# EAGLE design sensor 8 (EAGLE 5.06)
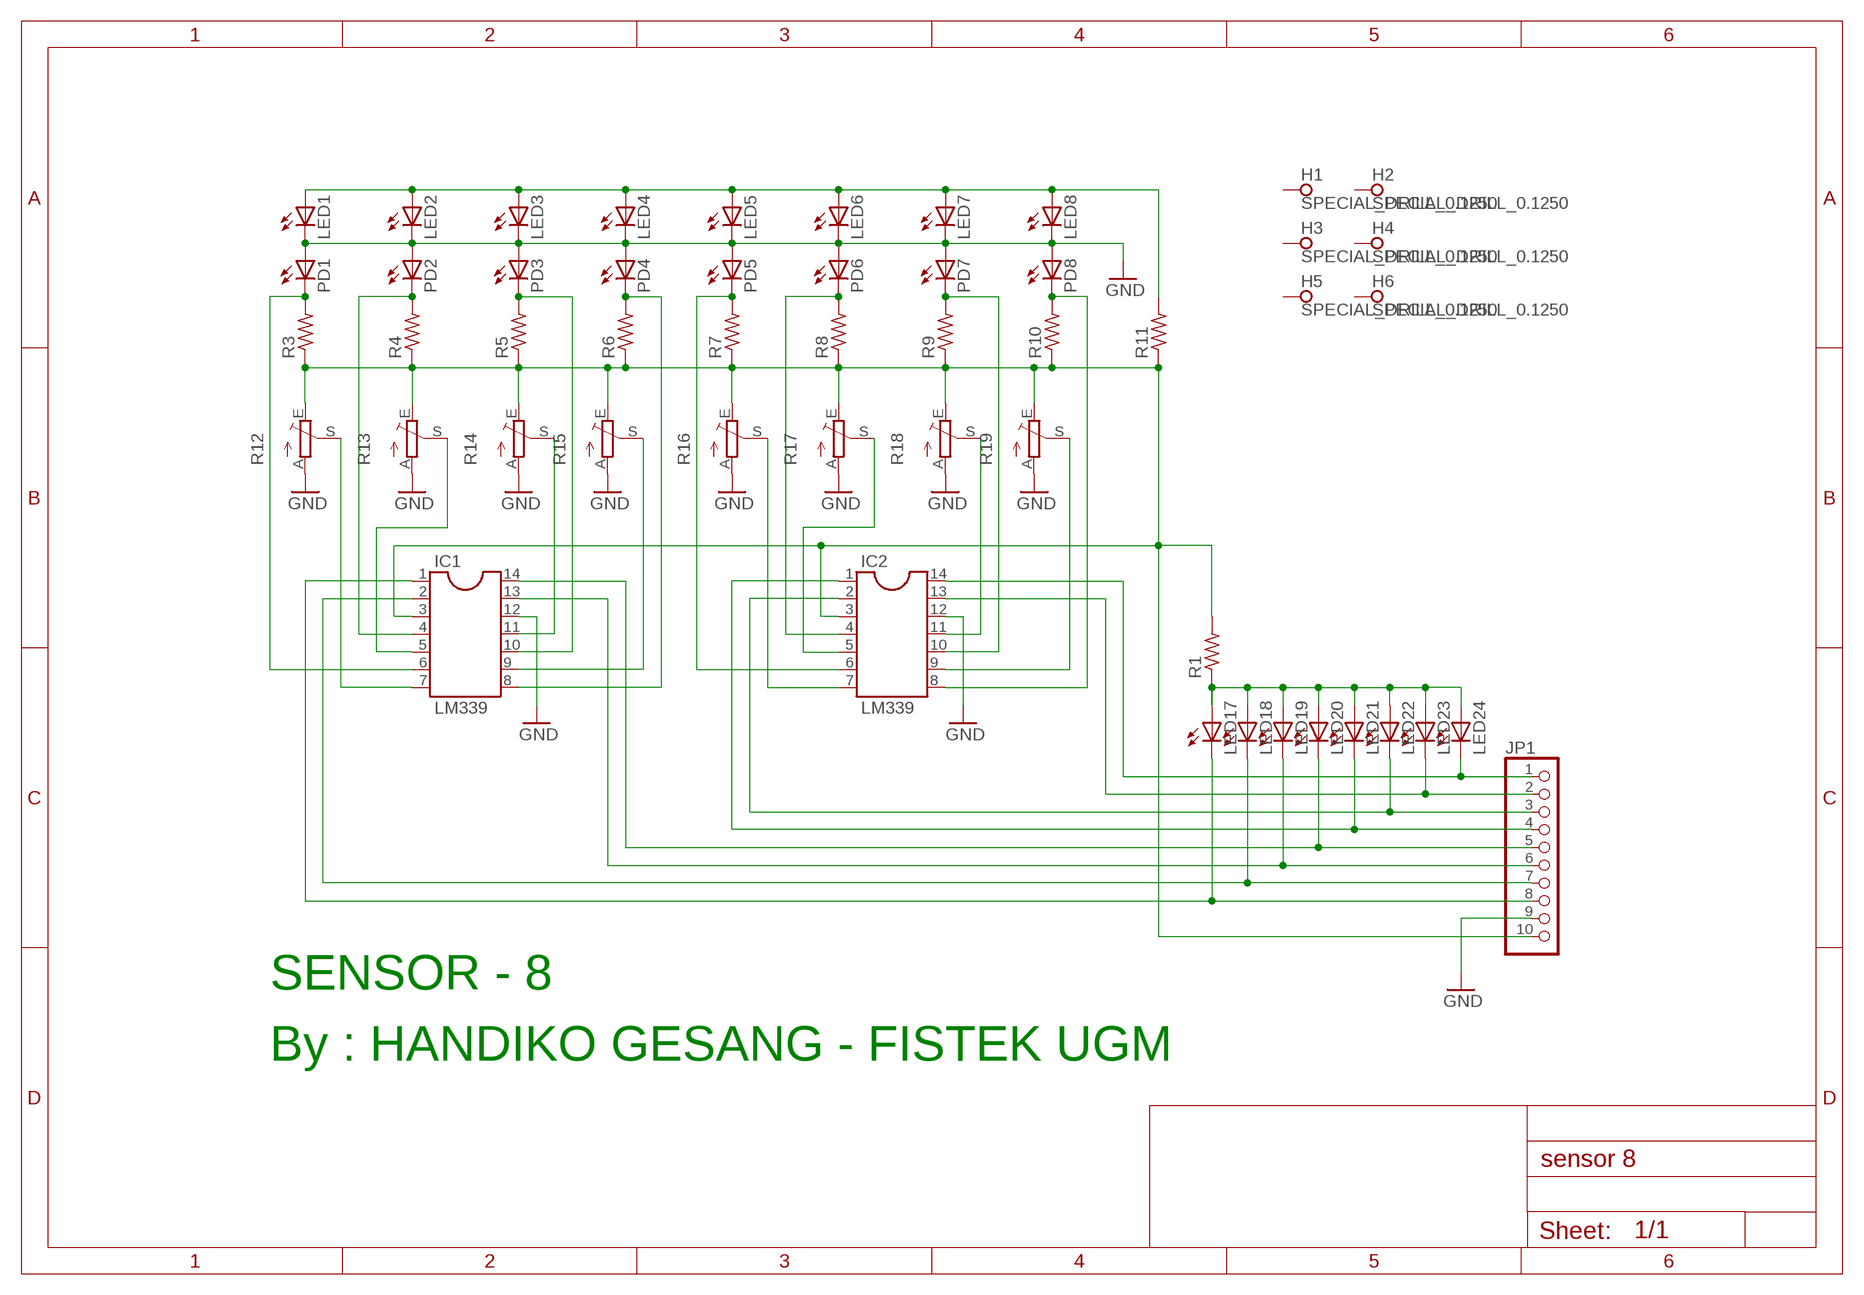
[diagram p0: schematic, sheet 1]

## Parts
H1  SPECIAL_DRILL_0.1250  [PAD_0.1250]
H2  SPECIAL_DRILL_0.1250  [PAD_0.1250]
H3  SPECIAL_DRILL_0.1250  [PAD_0.1250]
H4  SPECIAL_DRILL_0.1250  [PAD_0.1250]
H5  SPECIAL_DRILL_0.1250  [PAD_0.1250]
H6  SPECIAL_DRILL_0.1250  [PAD_0.1250]
IC1  LM339  DIL14  [DIL14]
IC2  LM339  DIL14  [DIL14]
JP1  PINHD-1X10  [1X10]
LED1  LED5MM  [LED5MM]
LED2  LED5MM  [LED5MM]
LED3  LED5MM  [LED5MM]
LED4  LED5MM  [LED5MM]
LED5  LED5MM  [LED5MM]
LED6  LED5MM  [LED5MM]
LED7  LED5MM  [LED5MM]
LED8  LED5MM  [LED5MM]
LED17  LED5MM  [LED5MM]
LED18  LED5MM  [LED5MM]
LED19  LED5MM  [LED5MM]
LED20  LED5MM  [LED5MM]
LED21  LED5MM  [LED5MM]
LED22  LED5MM  [LED5MM]
LED23  LED5MM  [LED5MM]
LED24  LED5MM  [LED5MM]
PD1  LED5MM  [LED5MM]
PD2  LED5MM  [LED5MM]
PD3  LED5MM  [LED5MM]
PD4  LED5MM  [LED5MM]
PD5  LED5MM  [LED5MM]
PD6  LED5MM  [LED5MM]
PD7  LED5MM  [LED5MM]
PD8  LED5MM  [LED5MM]
R1  R-US_0309/10  [0309/10]
R3  R-US_0309/10  [0309/10]
R4  R-US_0309/10  [0309/10]
R5  R-US_0309/10  [0309/10]
R6  R-US_0309/10  [0309/10]
R7  R-US_0309/10  [0309/10]
R8  R-US_0309/10  [0309/10]
R9  R-US_0309/10  [0309/10]
R10  R-US_0309/10  [0309/10]
R11  R-US_0309/10  [0309/10]
R12  TRIM_EU-LI10  [LI10]
R13  TRIM_EU-LI10  [LI10]
R14  TRIM_EU-LI10  [LI10]
R15  TRIM_EU-LI10  [LI10]
R16  TRIM_EU-LI10  [LI10]
R17  TRIM_EU-LI10  [LI10]
R18  TRIM_EU-LI10  [LI10]
R19  TRIM_EU-LI10  [LI10]

## Nets
GND: IC1.12 IC2.12 JP1.9 LED1.K(C) LED2.K(C) LED3.K(C) LED4.K(C) LED5.K(C) LED6.K(C) LED7.K(C) LED8.K(C) PD1.A PD2.A PD3.A PD4.A PD5.A PD6.A PD7.A PD8.A R12.A R13.A R14.A R15.A R16.A R17.A R18.A R19.A
N$1: IC1.14 JP1.5 LED20.K(C)
N$2: LED17.A LED18.A LED19.A LED20.A LED21.A LED22.A LED23.A LED24.A R1.1
N$9: IC1.6 PD1.K(C) R3.2
N$10: IC1.4 PD2.K(C) R4.2
N$11: IC1.10 PD3.K(C) R5.2
N$12: IC1.8 PD4.K(C) R6.2
N$13: IC2.6 PD5.K(C) R7.2
N$14: IC2.4 PD6.K(C) R8.2
N$15: IC2.10 PD7.K(C) R9.2
N$16: IC2.8 PD8.K(C) R10.2
N$18: IC1.3 IC2.3 JP1.10 R1.2 R3.1 R4.1 R5.1 R6.1 R7.1 R8.1 R9.1 R10.1 R11.1 R12.E R13.E R14.E R15.E R16.E R17.E R18.E R19.E
N$19: LED1.A LED2.A LED3.A LED4.A LED5.A LED6.A LED7.A LED8.A R11.2
N$20: IC1.7 R12.S
N$21: IC1.5 R13.S
N$22: IC1.11 R14.S
N$23: IC1.9 R15.S
N$24: IC2.7 R16.S
N$25: IC2.5 R17.S
N$26: IC2.11 R18.S
N$27: IC2.9 R19.S
N$28: IC2.14 JP1.1 LED24.K(C)
N$29: IC2.13 JP1.2 LED23.K(C)
N$30: IC2.2 JP1.3 LED22.K(C)
N$31: IC2.1 JP1.4 LED21.K(C)
N$33: IC1.13 JP1.6 LED19.K(C)
N$34: IC1.2 JP1.7 LED18.K(C)
N$35: IC1.1 JP1.8 LED17.K(C)
Unconnected: H1.1 H2.1 H3.1 H4.1 H5.1 H6.1

## Notes on the sheet
- SENSOR - 8
- By : HANDIKO GESANG - FISTEK UGM

## Library data of the parts
H1-H6 = special-drill:SPECIAL_DRILL_: Special drills
IC1 IC2 = ic-package:DIL14: Dual In Line / Socket
JP1 = pinhead:PINHD-1X10: PIN HEADER
LED1-LED8 LED17-LED24 PD1-PD8 = led:LED: LED OSRAM: - CHIPLED LG R971, LG N971, LY N971, LG Q971, LY Q971, LO R971, LY R971 LH N974, LH R974 LS Q976, LO Q976, LY Q976 LO Q996 - Hyper CHIPLED LW Q18S LB Q993, LB Q99A, LB R99A - SideLED LS A670, LO A670, LY A670, LG A670, LP A670 LB A673, LV A673, LT A673, LW A673 LH A674 LY A675 LS A676, LA A676, LO A676, LY A676, LW A676 LS A679, LY A679, LG A679 - Hyper Micro SIDELED® LS Y876, LA Y876, LO Y876, LY Y876 LT Y87S - SmartLED LW L88C, LW L88S LB L89C, LB L89S, LG L890 LS L89K, LO L89K, LY L89K LS L896, LA L896, LO L896, LY L896 - TOPLED LS T670, LO T670, LY T670, LG T670, LP T670 LSG T670, LSP T670, LSY T670, LOP T670, LYG T670 LG T671, LOG T671, LSG T671 LB T673, LV T673, LT T673, LW T673 LH T674 LS T676, LA T676, LO T676, LY T676, LB T676, LH T676, LSB T676, LW T676 LB T67C, LV T67C, LT T67C, LS T67K, LO T67K, LY T67K, LW E67C LS E67B, LA E67B, LO E67B, LY E67B, LB E67C, LV E67C, LT E67C LW T67C LS T679, LY T679, LG T679 LS T770, LO T770, LY T770, LG T770, LP T770 LB T773, LV T773, LT T773, LW T773 LH T774 LS E675, LA E675, LY E675, LS T675 LS T776, LA T776, LO T776, LY T776, LB T776 LHGB T686 LT T68C, LB T68C - Hyper Mini TOPLED® LB M676 - Mini TOPLED Santana® LG M470 LS M47K, LO M47K, LY M47K Source: http://www.osram.convergy.de LUXEON: - LUMILED® LXK2-PW12-R00, LXK2-PW12-S00, LXK2-PW14-U00, LXK2-PW14-V00 LXK2-PM12-R00, LXK2-PM12-S00, LXK2-PM14-U00 LXK2-PE12-Q00, LXK2-PE12-R00, LXK2-PE12-S00, LXK2-PE14-T00, LXK2-PE14-U00 LXK2-PB12-K00, LXK2-PB12-L00, LXK2-PB12-M00, LXK2-PB14-N00, LXK2-PB14-P00, LXK2-PB14-Q00 LXK2-PR12-L00, LXK2-PR12-M00, LXK2-PR14-Q00, LXK2-PR14-R00 LXK2-PD12-Q00, LXK2-PD12-R00, LXK2-PD12-S00 LXK2-PH12-R00, LXK2-PH12-S00 LXK2-PL12-P00, LXK2-PL12-Q00, LXK2-PL12-R00 Source: www.luxeon.com KINGBRIGHT: KA-3528ASYC Source: www.kingbright.com
R1 R3-R11 = resistor:R-US_: RESISTOR, American symbol
R12-R19 = pot:TRIM_EU-: POTENTIOMETER

## Board
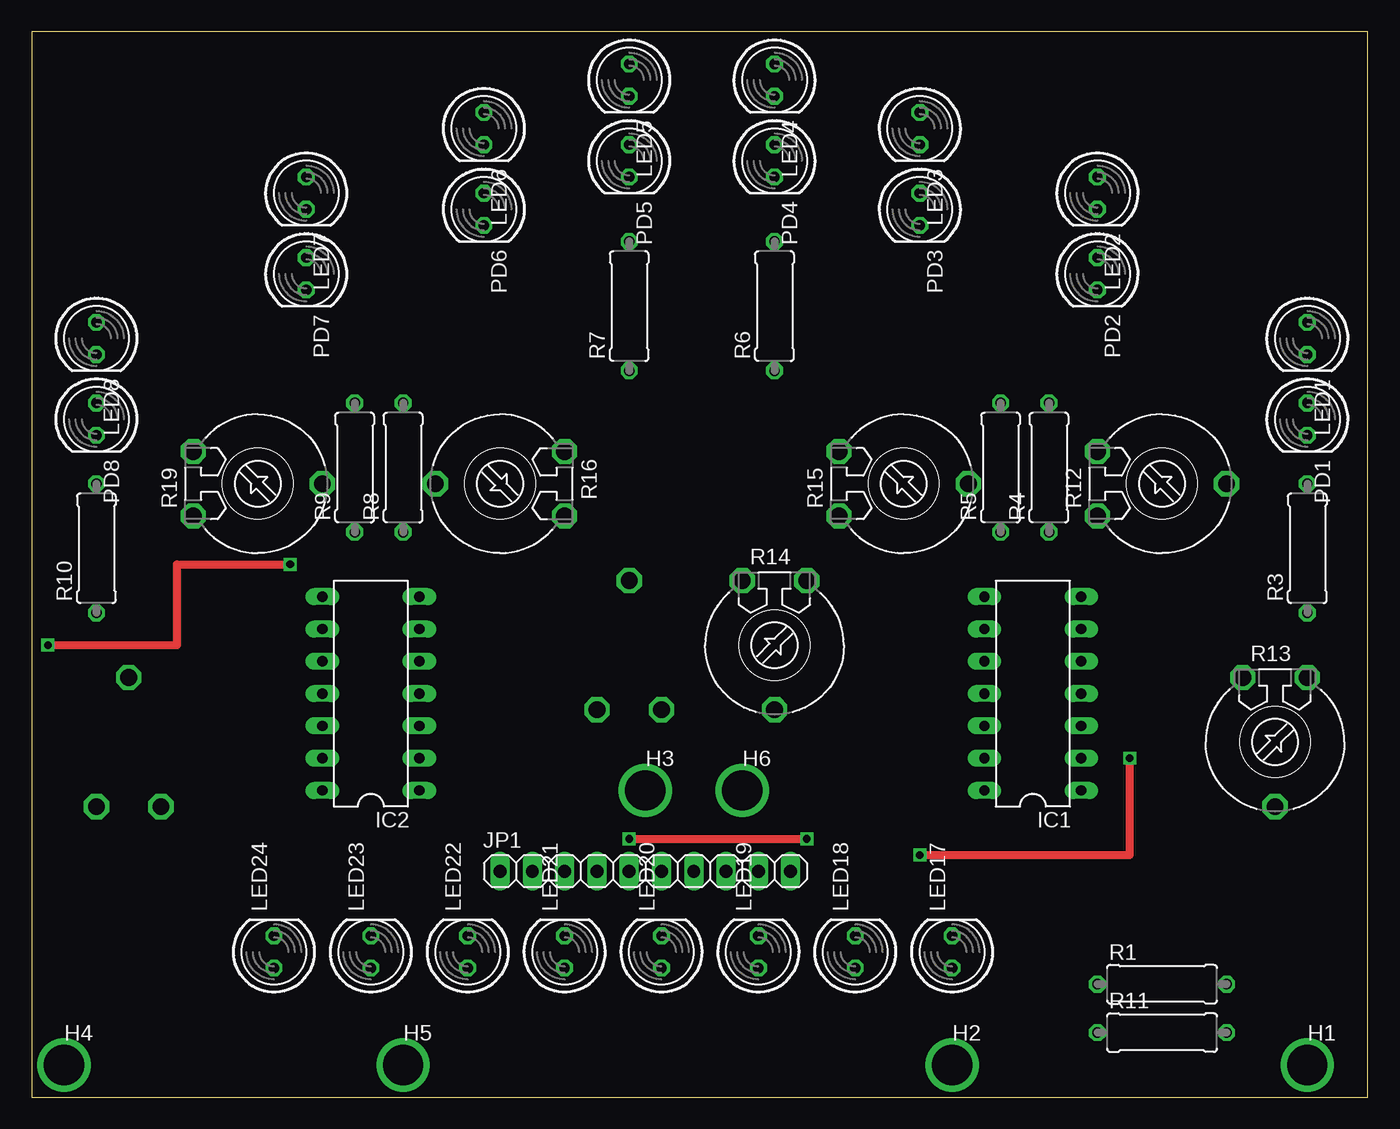
[diagram p1: board, top side]
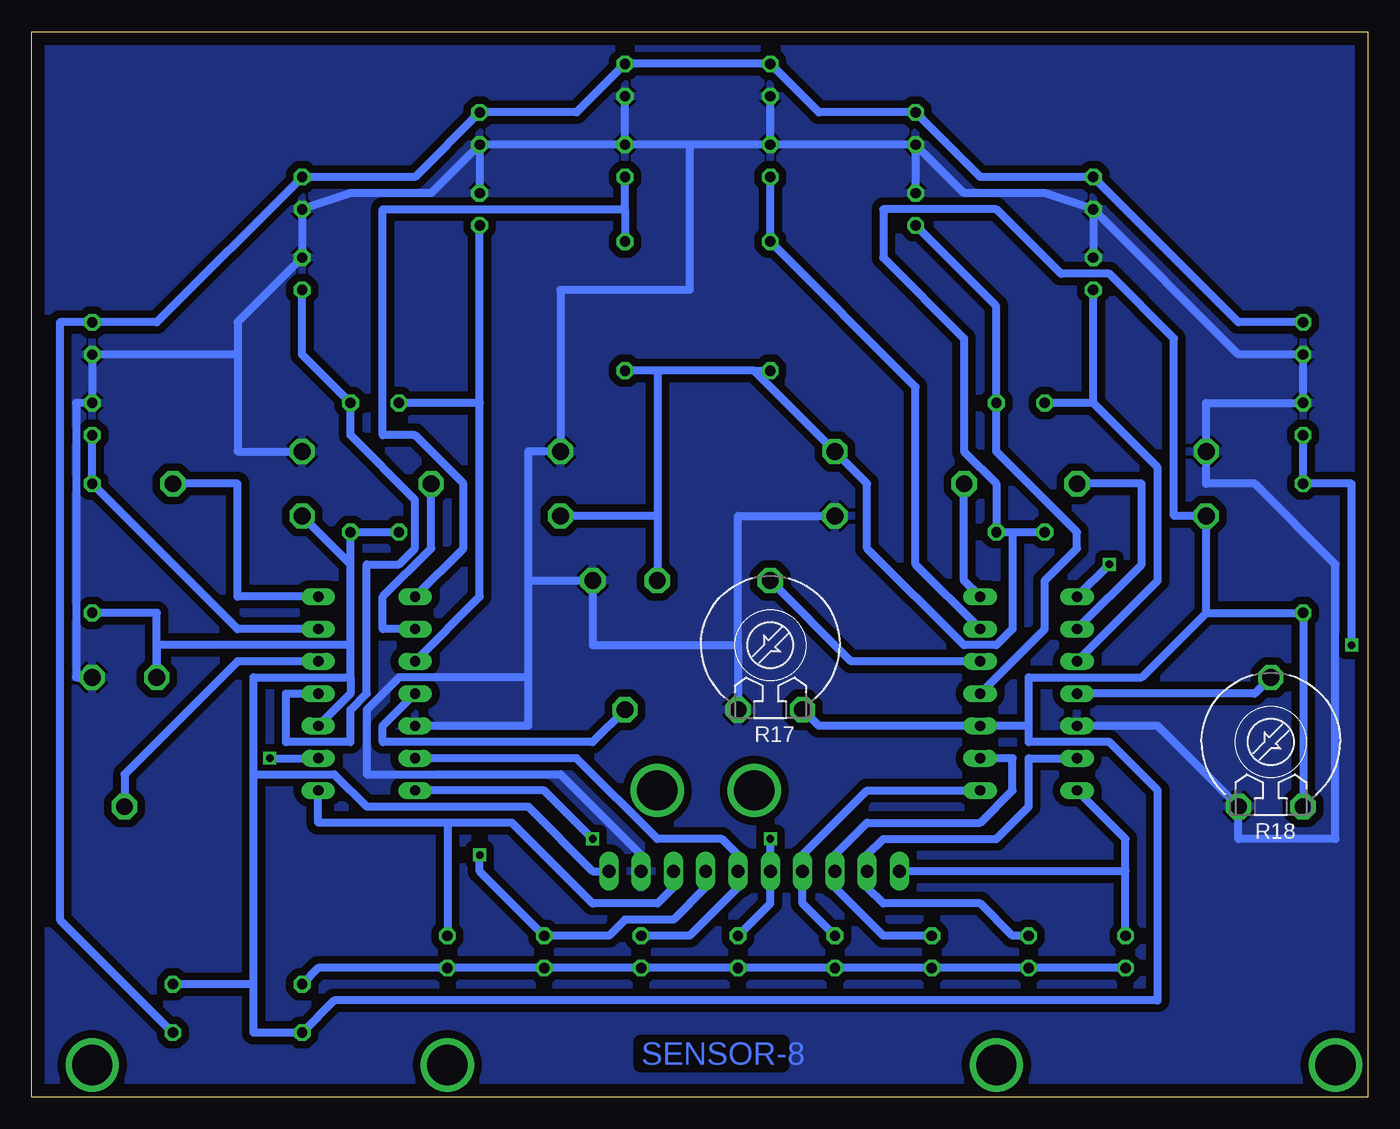
[diagram p2: board, bottom side, seen from below]

Size 105.08 x 83.81 mm. Coordinates in mm from the lower left corner, seen from the top.
Outline: 0,0 105.08,0 105.08,83.81 0,83.81 0,0
Copper layers (1*16): Top 0.035mm / dielectric 1.5mm / Bottom 0.035mm
Design rules "default *": minimum track width 25mil, minimum drill 24mil, track to track 10mil, track to pad 10mil, pad to pad 10mil, via to via 10mil, smd to smd 8mil, copper to edge 40mil, drill to drill 8mil, minimum pad ring 10mil, minimum via ring 8mil, stop-mask expansion 4mil, vias tented up to drill 0mil, thermal gap 10mil

### Footprints (pad centres in the part's own frame; a part is rotated, then mirrored left to right if it is on the bottom)
PAD_0.1250 = drill 3.175 pad 3.175 round: 1 0,0
DIL14 = drill 0.813 long: 1 -7.62,-3.81; 2 -5.08,-3.81; 3 -2.54,-3.81; 4 0,-3.81; 5 2.54,-3.81; 6 5.08,-3.81; 7 7.62,-3.81; 8 7.62,3.81; 9 5.08,3.81; 10 2.54,3.81; 11 0,3.81; 12 -2.54,3.81; 13 -5.08,3.81; 14 -7.62,3.81
1X10 = drill 1.016 long: 1 -11.43,0; 2 -8.89,0; 3 -6.35,0; 4 -3.81,0; 5 -1.27,0; 6 1.27,0; 7 3.81,0; 8 6.35,0; 9 8.89,0; 10 11.43,0
LED5MM = drill 0.813 octagon: A -1.27,0; K 1.27,0
0309/10 = drill 0.813 octagon: 1 -5.08,0; 2 5.08,0
LI10 = drill 1.321 octagon: A -2.54,-5.08; E 2.54,-5.08; S 0,5.08

### Placement (x,y rotation side)
H1  100.33,2.54 0 top
H2  72.39,2.54 0 top
H3  48.26,24.13 0 top
H4  2.54,2.54 0 top
H5  29.21,2.54 0 top
H6  55.88,24.13 0 top
IC1  78.74,31.75 90 top
IC2  26.67,31.75 90 top
JP1  48.26,17.78 0 top
LED1  100.33,59.69 270 top
LED2  83.82,71.12 270 top
LED3  69.85,76.2 270 top
LED4  58.42,80.01 270 top
LED5  46.99,80.01 270 top
LED6  35.56,76.2 270 top
LED7  21.59,71.12 270 top
LED8  5.08,59.69 270 top
LED17  72.39,11.43 90 top
LED18  64.77,11.43 90 top
LED19  57.15,11.43 90 top
LED20  49.53,11.43 90 top
LED21  41.91,11.43 90 top
LED22  34.29,11.43 90 top
LED23  26.67,11.43 90 top
LED24  19.05,11.43 90 top
PD1  100.33,53.34 270 top
PD2  83.82,64.77 270 top
PD3  69.85,69.85 270 top
PD4  58.42,73.66 270 top
PD5  46.99,73.66 270 top
PD6  35.56,69.85 270 top
PD7  21.59,64.77 270 top
PD8  5.08,53.34 270 top
R1  88.9,8.89 0 top
R3  100.33,43.18 90 top
R4  80.01,49.53 90 top
R5  76.2,49.53 90 top
R6  58.42,62.23 90 top
R7  46.99,62.23 90 top
R8  29.21,49.53 90 top
R9  25.4,49.53 90 top
R10  5.08,43.18 90 top
R11  88.9,5.08 0 top
R12  88.9,48.26 270 top
R13  97.79,27.94 180 top
R14  58.42,35.56 180 top
R15  68.58,48.26 270 top
R16  36.83,48.26 90 top
R17  46.99,35.56 0 bottom
R18  7.62,27.94 0 bottom
R19  17.78,48.26 270 top

### Tracks (layer width: path | path; a pad name or v marks a point on that pad's centre or on a via)
GND
  Bottom 0.635: LED3.K PD3.A | PD4.A LED4.K | PD5.A LED5.K | LED7.K PD7.A | LED6.K PD6.A | LED7.K 25.4,71.12 31.75,71.12 LED6.K | LED6.K PD5.A | PD5.A 48.26,74.93 | 48.26,74.93 PD4.A | PD4.A LED3.K | LED3.K 73.66,71.12 80.01,71.12 LED2.K PD2.A 88.9,60.96 | R13.A 101.6,33.02 101.6,54.61 PD1.A LED1.K 88.9,58.42 88.9,60.96 | 48.26,74.93 53.34,74.93 53.34,63.5 63.5,63.5 R15.A 66.04,50.8 66.04,40.64 | LED7.K 10.16,58.42 LED8.K PD8.A 12.7,54.61 R19.A 12.7,48.26 8.89,48.26 2.54,41.91 2.54,20.32 10.16,20.32 R18.A 16.51,29.21 IC2.12 | 66.04,40.64 R14.A 60.96,35.56 49.53,35.56 | 66.04,40.64 66.04,33.02 | 66.04,33.02 66.04,29.21 IC1.12 | JP1.9 57.15,19.05 63.5,25.4 78.74,25.4 78.74,30.48 76.2,33.02 66.04,33.02 | 49.53,35.56 R17.A | R16.A 49.53,45.72 49.53,35.56 | 88.9,60.96 88.9,50.8 R12.A
  pour Bottom (isolate 0.61): 0,83.82 105.41,83.82 105.41,0 0,0
N$1  (via drill 0.6 pad 1.02)
  Top 0.635: v46.99,20.32 v60.96,20.32
  Bottom 0.61: v60.96,20.32 64.77,24.13 IC1.14 | JP1.5 v46.99,20.32
  Bottom 0.635: LED20.K 46.99,15.24 JP1.5
N$2
  Bottom 0.635: LED24.A LED23.A LED22.A LED21.A LED20.A LED19.A LED18.A LED17.A 82.55,10.16 R1.1
N$9
  Bottom 0.635: IC1.6 88.9,36.83 R3.2 PD1.K
N$10
  Bottom 0.635: IC1.4 85.09,31.75 85.09,27.94 80.01,27.94 80.01,30.48 78.74,31.75 78.74,41.91 76.2,41.91 74.93,43.18 74.93,46.99 80.01,52.07 R4.2 83.82,58.42 PD2.K
N$11
  Bottom 0.635: IC1.10 69.85,39.37 69.85,54.61 | 69.85,54.61 PD3.K | 69.85,54.61 R5.2
N$12
  Bottom 0.635: 58.42,69.85 PD4.K | 58.42,69.85 R6.2 | IC1.8 71.12,43.18 71.12,48.26 74.93,52.07 77.47,52.07 77.47,69.85 58.42,69.85
N$13
  Bottom 0.635: IC2.6 35.56,41.91 35.56,55.88 R7.2 PD5.K
N$14
  Bottom 0.635: PD6.K 29.21,62.23 R8.2 29.21,50.8 22.86,44.45 22.86,43.18 25.4,40.64 25.4,36.83 IC2.4
N$15
  Bottom 0.635: 21.59,54.61 PD7.K | IC2.10 16.51,40.64 16.51,49.53 21.59,54.61 | 21.59,54.61 R9.2
N$16  (via drill 0.6 pad 1.02)
  Top 0.61: v1.27,35.56 11.43,35.56 11.43,41.91 v20.32,41.91
  Bottom 0.61: R10.2 1.27,48.26 v1.27,35.56 | v20.32,41.91 IC2.8
  Bottom 0.635: R10.2 PD8.K
N$18
  Bottom 0.61: R11.1 81.28,7.62 16.51,7.62 16.51,24.13 20.32,27.94
  Bottom 0.635: 27.94,44.45 R8.1 29.21,48.26 31.75,50.8 31.75,59.69 38.1,66.04 38.1,69.85 29.21,69.85 24.13,64.77 20.32,64.77 15.24,59.69 15.24,45.72 R19.E 12.7,38.1 | 27.94,44.45 R9.1 | 27.94,44.45 27.94,36.83 29.21,35.56 31.75,35.56 39.37,43.18 39.37,48.26 R16.E 48.26,57.15 | 55.88,57.15 R6.1 | 48.26,57.15 55.88,57.15 | 48.26,57.15 R7.1 | 55.88,57.15 55.88,45.72 | 55.88,45.72 R14.E | 55.88,45.72 R15.E | R3.1 95.25,38.1 R13.E 95.25,35.56 80.01,35.56 | R4.1 R5.1 R4.1 | R17.E 43.18,29.21 IC2.3 26.67,29.21 | R18.E R10.1 12.7,38.1 | 26.67,29.21 26.67,33.02 17.78,33.02 12.7,38.1 | IC1.3 80.01,31.75 80.01,33.02 | 80.01,41.91 R4.1 | 80.01,35.56 80.01,41.91 | 80.01,33.02 80.01,35.56 | 80.01,41.91 R12.E | 87.63,5.08 87.63,8.89 R1.2 | JP1.10 60.96,17.78 66.04,22.86 78.74,22.86 81.28,25.4 87.63,25.4 87.63,22.86 | R11.1 87.63,5.08 | 87.63,5.08 87.63,22.86 | 80.01,33.02 87.63,33.02 87.63,22.86 | 26.67,29.21 26.67,27.94 20.32,27.94
N$19
  Bottom 0.635: R11.2 102.87,13.97 102.87,60.96 LED1.A 95.25,60.96 LED2.A 74.93,72.39 LED3.A 62.23,77.47 LED4.A LED5.A 43.18,77.47 LED6.A 30.48,72.39 LED7.A 10.16,60.96 LED8.A
N$20
  Bottom 0.635: IC1.7 88.9,39.37 88.9,48.26 R12.S
N$21
  Bottom 0.635: IC1.5 88.9,34.29 97.79,25.4 R13.S
N$22
  Bottom 0.635: IC1.11 77.47,29.21 77.47,27.94 60.96,27.94 R14.S
N$23
  Bottom 0.635: IC1.9 77.47,36.83 77.47,39.37 73.66,43.18 R15.S
N$24
  Bottom 0.635: IC2.7 31.75,40.64 R16.S
N$25
  Bottom 0.635: IC2.5 40.64,34.29 R17.S
N$26
  Bottom 0.635: IC2.11 8.89,31.75 R18.S
N$27
  Bottom 0.635: IC2.9 17.78,41.91 17.78,48.26 R19.S
N$28
  Bottom 0.635: 19.05,17.78 19.05,20.32 IC2.14 | LED24.K 19.05,17.78 | 19.05,17.78 JP1.1
N$29
  Bottom 0.635: IC2.13 26.67,26.67 26.67,22.86 29.21,20.32 38.1,20.32 39.37,19.05 JP1.2 39.37,16.51 38.1,15.24 30.48,15.24 27.94,12.7 LED23.K
N$30
  Bottom 0.635: LED22.K 38.1,12.7 41.91,16.51 JP1.3 41.91,19.05 39.37,21.59 30.48,21.59 27.94,24.13 27.94,26.67 IC2.2
N$31
  Bottom 0.635: IC2.1 39.37,24.13 44.45,19.05 JP1.4 44.45,15.24 LED21.K
N$33
  Bottom 0.635: LED19.K 53.34,12.7 49.53,16.51 JP1.6 49.53,19.05 50.8,20.32 55.88,20.32 62.23,26.67 IC1.13
N$34  (via drill 0.6 pad 1.02)
  Top 0.61: v69.85,19.05 86.36,19.05 v86.36,26.67
  Bottom 0.61: LED18.K 69.85,17.78 v69.85,19.05 | v86.36,26.67 IC1.2
  Bottom 0.635: LED18.K 59.69,12.7 58.42,13.97 54.61,13.97 52.07,16.51 JP1.7
N$35
  Bottom 0.635: 72.39,21.59 82.55,21.59 IC1.1 | 72.39,21.59 LED17.K | JP1.8 54.61,16.51 55.88,15.24 60.96,15.24 67.31,21.59 72.39,21.59

### Text on the board
Bottom: SENSOR-8